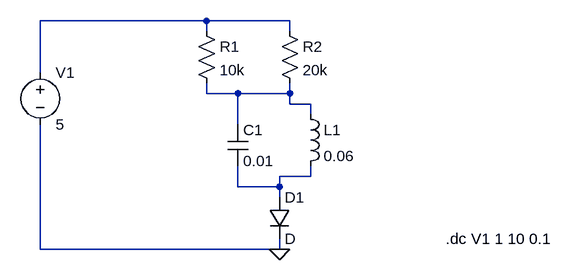
[diagram p0: schematic LT_VERSION_4_1.asc]
LT_VERSION_4_1.asc, the LTspice schematic file:
Version 4.1
SHEET 1 880 680
WIRE 384 384 384 400
WIRE 16 208 16 224
WIRE 384 400 16 400
WIRE 16 400 16 224
FLAG 384 400 0
WIRE 272 64 272 48
WIRE 400 64 400 48
WIRE 16 128 16 112
WIRE 272 48 400 48
WIRE 272 48 16 48
WIRE 16 48 16 112
WIRE 320 208 320 192
WIRE 432 192 432 176
WIRE 272 144 272 160
WIRE 400 144 400 160
WIRE 320 192 320 160
WIRE 320 160 272 160
WIRE 320 160 400 160
WIRE 400 160 400 176
WIRE 400 176 432 176
WIRE 320 272 320 288
WIRE 384 320 384 304
WIRE 432 272 432 288
WIRE 320 288 320 304
WIRE 320 304 384 304
WIRE 384 304 384 288
WIRE 384 288 432 288
SYMBOL voltage 16 112 R0
WINDOW 123 0 0 Left 0
WINDOW 39 0 0 Left 0
SYMATTR InstName V1
SYMATTR Value 5
SYMBOL res 256 48 R0
SYMATTR InstName R1
SYMATTR Value 10k
SYMBOL res 384 48 R0
SYMATTR InstName R2
SYMATTR Value 20k
SYMBOL cap 304 208 R0
SYMATTR InstName C1
SYMATTR Value 0.01
SYMBOL ind 416 176 R0
SYMATTR InstName L1
SYMATTR Value 0.06
SYMATTR SpiceLine Rser=1m
SYMBOL diode 368 320 R0
SYMATTR InstName D1
TEXT 640 384 Left 2 !.dc V1 1 10 0.1

The netlist it stands for:
* LT_VERSION_4_1.asc
V1 N001 0 5
R1 N001 N002 10k
R2 N001 N002 20k
C1 N002 N003 0.01
L1 N002 N003 0.06 Rser=1m
D1 N003 0 D
.model D D
.lib standard.dio
.dc V1 1 10 0.1
.backanno
.end